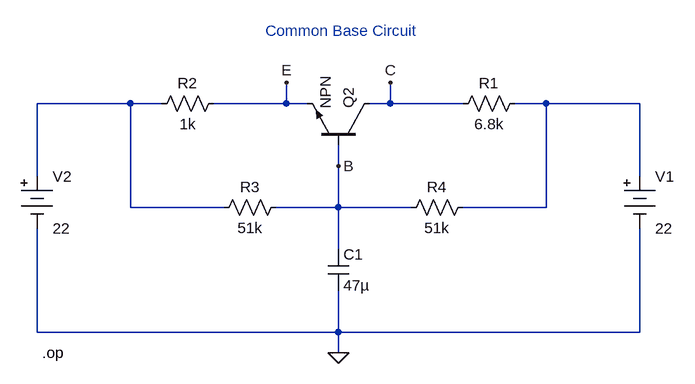
[diagram p0: schematic 2EEB_VELASCO_EXPT7_CKT5.asc]
2EEB_VELASCO_EXPT7_CKT5.asc, the LTspice schematic file:
Version 4
SHEET 1 880 680
WIRE -560 -32 -704 -32
WIRE -512 -32 -560 -32
WIRE -320 -32 -320 -64
WIRE -320 -32 -432 -32
WIRE -288 -32 -320 -32
WIRE -160 -32 -160 -64
WIRE -160 -32 -192 -32
WIRE -48 -32 -160 -32
WIRE 80 -32 32 -32
WIRE 224 -32 80 -32
WIRE -240 64 -240 32
WIRE -704 80 -704 -32
WIRE 224 80 224 -32
WIRE -560 128 -560 -32
WIRE -416 128 -560 128
WIRE -240 128 -240 64
WIRE -240 128 -336 128
WIRE -128 128 -240 128
WIRE 80 128 80 -32
WIRE 80 128 -48 128
WIRE -240 192 -240 128
WIRE -704 320 -704 160
WIRE -240 320 -240 256
WIRE -240 320 -704 320
WIRE 224 320 224 160
WIRE 224 320 -240 320
WIRE -240 352 -240 320
FLAG -240 352 0
FLAG -240 64 B
FLAG -320 -64 E
FLAG -160 -64 C
SYMBOL npn -192 32 M270
SYMATTR InstName Q2
SYMBOL res 48 -48 R90
WINDOW 0 0 56 VBottom 2
WINDOW 3 32 56 VTop 2
SYMATTR InstName R1
SYMATTR Value 6.8k
SYMBOL res -416 -48 R90
WINDOW 0 0 56 VBottom 2
WINDOW 3 32 56 VTop 2
SYMATTR InstName R2
SYMATTR Value 1k
SYMBOL res -320 112 R90
WINDOW 0 0 56 VBottom 2
WINDOW 3 32 56 VTop 2
SYMATTR InstName R3
SYMATTR Value 51k
SYMBOL cap -256 192 R0
SYMATTR InstName C1
SYMATTR Value 47µ
SYMBOL Misc\\battery 224 64 R0
SYMATTR InstName V1
SYMATTR Value 22
SYMBOL Misc\\battery -704 64 R0
SYMATTR InstName V2
SYMATTR Value 22
SYMBOL res -32 112 R90
WINDOW 0 0 56 VBottom 2
WINDOW 3 32 56 VTop 2
SYMATTR InstName R4
SYMATTR Value 51k
TEXT -352 -144 Left 2 ;Common Base Circuit
TEXT -696 352 Left 2 !.op

The netlist it stands for:
* 2EEB_VELASCO_EXPT7_CKT5.asc
Q2 C B E 0 NPN
R1 N002 C 6.8k
R2 E N001 1k
R3 B N001 51k
C1 B 0 47µ
V1 N002 0 22
V2 N001 0 22
R4 N002 B 51k
.model NPN NPN
.model PNP PNP
.lib standard.bjt
* Common Base Circuit
.op
.backanno
.end